# Altium schematic sheet cell_ballance.SchDoc
size A4; SheetNumber: 3; SheetTotal: 3
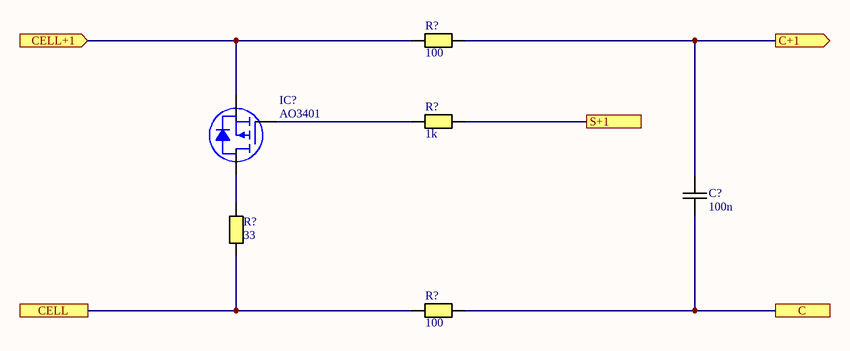
[diagram p0: cell_ballance.SchDoc]

## Parts
(Parts that share a designator on the sheet are numbered #1, #2 ... from top to bottom, then left to right.)
C?  100n  [CAPC0201(0603)33_N]
IC?  AO3401  [DIODES SOT-23-3]
R?#1  100  [RESC0201(0603)_N]
R?#2  1k  [RESC0201(0603)_N]
R?#3  33  [RESC2512(6432)_N]
R?#4  100  [RESC0201(0603)_N]

## Ports
C, C+1 (out), CELL, CELL+1 (in), S+1

## Nets
C: C?.2 R?#4.1 ; port C
C+1: C?.1 R?#1.1 ; port C+1
CELL: R?#3.2 R?#4.2 ; port CELL
CELL+1: IC?.2(S) R?#1.2 ; port CELL+1
S+1: R?#2.2 ; port S+1
NetIC?_1: IC?.1(G) R?#2.1
NetIC?_3: IC?.3(D) R?#3.1

## Library data of the parts
C? = Capacitor M: Ceramic capacitor Medium density; Value: 100n
IC? = DMG3401LSN-7: MOSFET P-CH 30V 3A SC59; Manufacturer: Diodes Incorporated; Current - Continuous Drain (Id) @ 25°C: 3A (Ta); Drive Voltage (Max Rds On,  Min Rds On): 2.5V, 10V; FET Type: P-Channel; Gate Charge (Qg) (Max) @ Vgs: 25.1 nC @ 10 V; Input Capacitance (Ciss) (Max) @ Vds: 1326 pF @ 15 V; Power Dissipation (Max): 800mW (Ta); Rds On (Max) @ Id, Vgs: 50mOhm @ 4A, 10V; Vgs (Max): ±12V; Vgs(th) (Max) @ Id: 1.3V @ 250µA; Part Number: DMG3401LSN-7; ComponentLink1Description: Datasheet; ComponentLink1URL: https://www.diodes.com/assets/Datasheets/DMG3401LSN.pdf; ComponentLink2Description: DigiKey Link; ComponentLink2URL: https://www.digikey.com/en/products/detail/diodes-incorporated/DMG3401LSN-7/3720138; Drain to Source Voltage (Vdss): 30 V; LastUpdated: 19.09.2022 14:00:15; Lifecycle Status: Active; Minimum Order: 1; Mounting Type: Surface Mount; Operating Temperature: -55°C ~ 150°C (TJ); Package / Case: TO-236-3, SC-59, SOT-23-3; Packaging: TapeAndReel; Part Status: Active; Price: 0.09; Series: -; Supplier 1: DigiKey; Supplier Part Number 1: DMG3401LSN-7DICT-ND; Supplier Device Package: SC-59-3; Technology: MOSFET (Metal Oxide)
R?#1-R?#4 = Resistor M: Resistor Medium Density
  R?#1 R?#4: Value: 100
  R?#2: Value: 1k
  R?#3: Value: 33